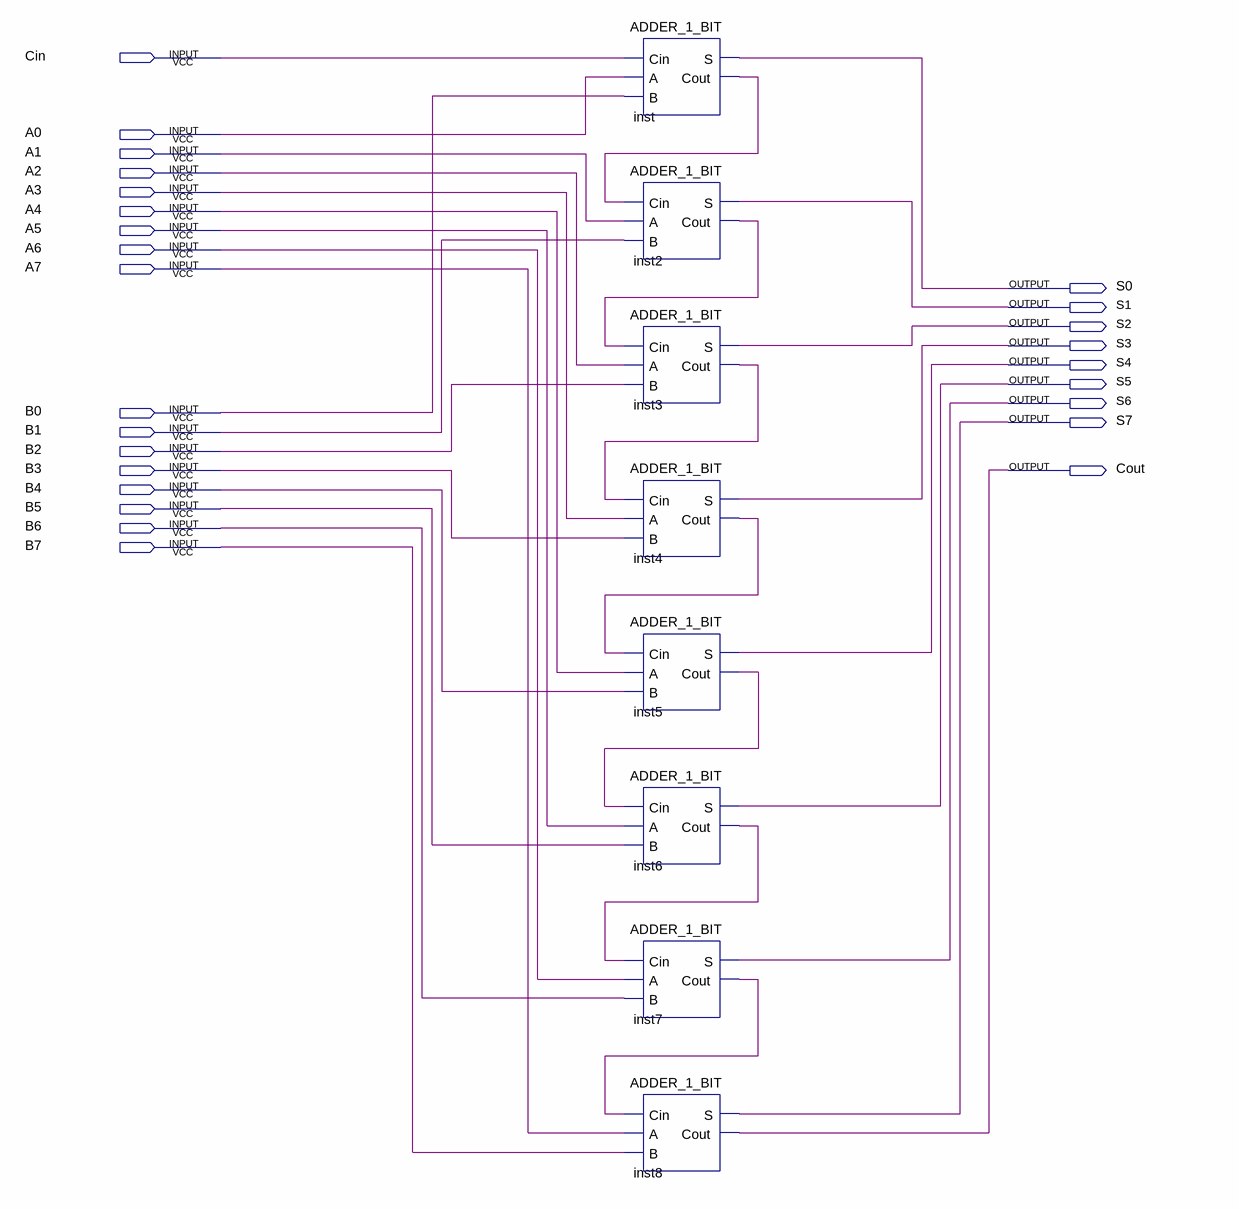
[diagram p0: schematic sheet]
// Quartus schematic ADDER_8_BITS.bdf as structural Verilog: 8 symbols, 26 pins
module ADDER_8_BITS (
  input  Cin,
  input  A0,
  input  A1,
  input  A2,
  input  A3,
  input  A4,
  input  A5,
  input  A6,
  input  A7,
  input  B0,
  input  B1,
  input  B2,
  input  B3,
  input  B4,
  input  B5,
  input  B6,
  input  B7,
  output S0,
  output S1,
  output S2,
  output S3,
  output S4,
  output S5,
  output S6,
  output S7,
  output Cout
);

  wire inst2_cout, inst3_cout, inst4_cout, inst5_cout, inst6_cout, inst7_cout, inst_cout;

  ADDER_1_BIT inst (.Cin(Cin), .A(A0), .B(B0), .S(S0), .Cout(inst_cout));
  ADDER_1_BIT inst2 (.Cin(inst_cout), .A(A1), .B(B1), .S(S1), .Cout(inst2_cout));
  ADDER_1_BIT inst3 (.Cin(inst2_cout), .A(A2), .B(B2), .S(S2), .Cout(inst3_cout));
  ADDER_1_BIT inst4 (.Cin(inst3_cout), .A(A3), .B(B3), .S(S3), .Cout(inst4_cout));
  ADDER_1_BIT inst5 (.Cin(inst4_cout), .A(A4), .B(B4), .S(S4), .Cout(inst5_cout));
  ADDER_1_BIT inst6 (.Cin(inst5_cout), .A(A5), .B(B5), .S(S5), .Cout(inst6_cout));
  ADDER_1_BIT inst7 (.Cin(inst6_cout), .A(A6), .B(B6), .S(S6), .Cout(inst7_cout));
  ADDER_1_BIT inst8 (.Cin(inst7_cout), .A(A7), .B(B7), .S(S7), .Cout(Cout));
endmodule
